# EAGLE design microverb (EAGLE 6.6.0)
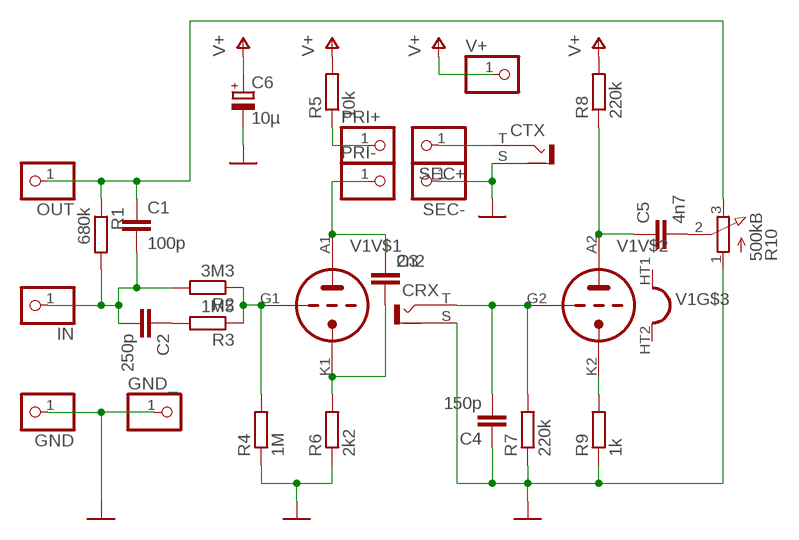
[diagram p0: schematic, sheet 1]

## Parts
C1  100p  C-EUC1206  [C1206]
C2  250p  C-EUC1206  [C1206]
C3  2n2  C-EUC1206  [C1206]
C4  150p  C-EUC1206  [C1206]
C5  4n7  C-EUC1206  [C1206]
C6  10µ  CPOL-EUE5-10.5  [E5-10,5]
CRX  BTOR1  [BTOR1]
CTX  BTOR1  [BTOR1]
GND  PINHD-1X1  [1X01]
GND_  PINHD-1X1  [1X01]
IN  PINHD-1X1  [1X01]
OUT  PINHD-1X1  [1X01]
PRI+  PINHD-1X1  [1X01]
PRI-  PINHD-1X1  [1X01]
R1  680k  R-EU_R1206  [R1206]
R2  3M3  R-EU_R1206  [R1206]
R3  1M5  R-EU_R1206  [R1206]
R4  1M  R-EU_R1206  [R1206]
R5  10k  R-EU_R2512  [R2512]
R6  2k2  R-EU_R1206  [R1206]
R7  220k  R-EU_R1206  [R1206]
R8  220k  R-EU_R1206  [R1206]
R9  1k  R-EU_R1206  [R1206]
R10  500kB  3RP/1610N  [3RP/1610N]
SEC+  PINHD-1X1  [1X01]
SEC-  PINHD-1X1  [1X01]
V1  6NXX-PIT  [6NXX-PIT]
V+  PINHD-1X1  [1X01]

## Nets
GND: C4.1 C6.- CRX.S CTX.S GND.1 GND_.1 R4.1 R6.1 R7.1 R9.1 R10.1(A) SEC-.1
N$1: C3.2 R6.2 V1.K1(V$1:TK)
N$2: R2.1 R3.1 R4.2 V1.G1(V$1:TG)
N$3: C4.2 CRX.T R7.2 V1.G2(V$2:TG)
N$4: R9.2 V1.K2(V$2:TK)
N$5: C2.1 R3.2
N$8: C5.1 R8.1 V1.A2(V$2:TA)
N$9: PRI+.1 R5.1
N$10: C3.1 PRI-.1 V1.A1(V$1:TA)
N$12: CTX.T SEC+.1
N$23: C1.2 C2.2 IN.1 R1.2 R2.2
N$24: C5.2 R10.2(S)
N$25: C1.1 OUT.1 R1.1 R10.3(E)
V+: C6.+ R5.2 R8.2 V+.1
Unconnected: CRX.S@1 CRX.S@2 CRX.S@3 CTX.S@1 CTX.S@2 CTX.S@3 V1.HT1(H1) V1.HT2(H2)

## Library data of the parts
C1-C5 = rcl:C-EU: CAPACITOR, European symbol
C6 = rcl:CPOL-EU: POLARIZED CAPACITOR, European symbol
CRX CTX = con-lumberg:BTOR1: RCA connectors according to JEITA RC-5231 Cinch RCA-Einbaukupplung nach JEITA RC-5231, stehende Ausführung Source: http://www.lumberg.de/Produkte/PDFs/BTOR1.pdf; MPN: BTOR 1; OC_FARNELL: 1217030; OC_NEWARK: 96K7172
GND GND_ IN OUT PRI+ PRI- SEC+ SEC- V+ = adafruit:PINHD-1X1: Pin header 1x1 for 0.1" spacing With round pins
R1-R9 = rcl:R-EU_: RESISTOR, European symbol
R10 = pot:3RP/1610N: 16mm Potentiometer one level Source: http://www.alphapotentiometers.net/html/16mm_pot_2.html
V1 = tubesC:6NXX-PIT

## Board
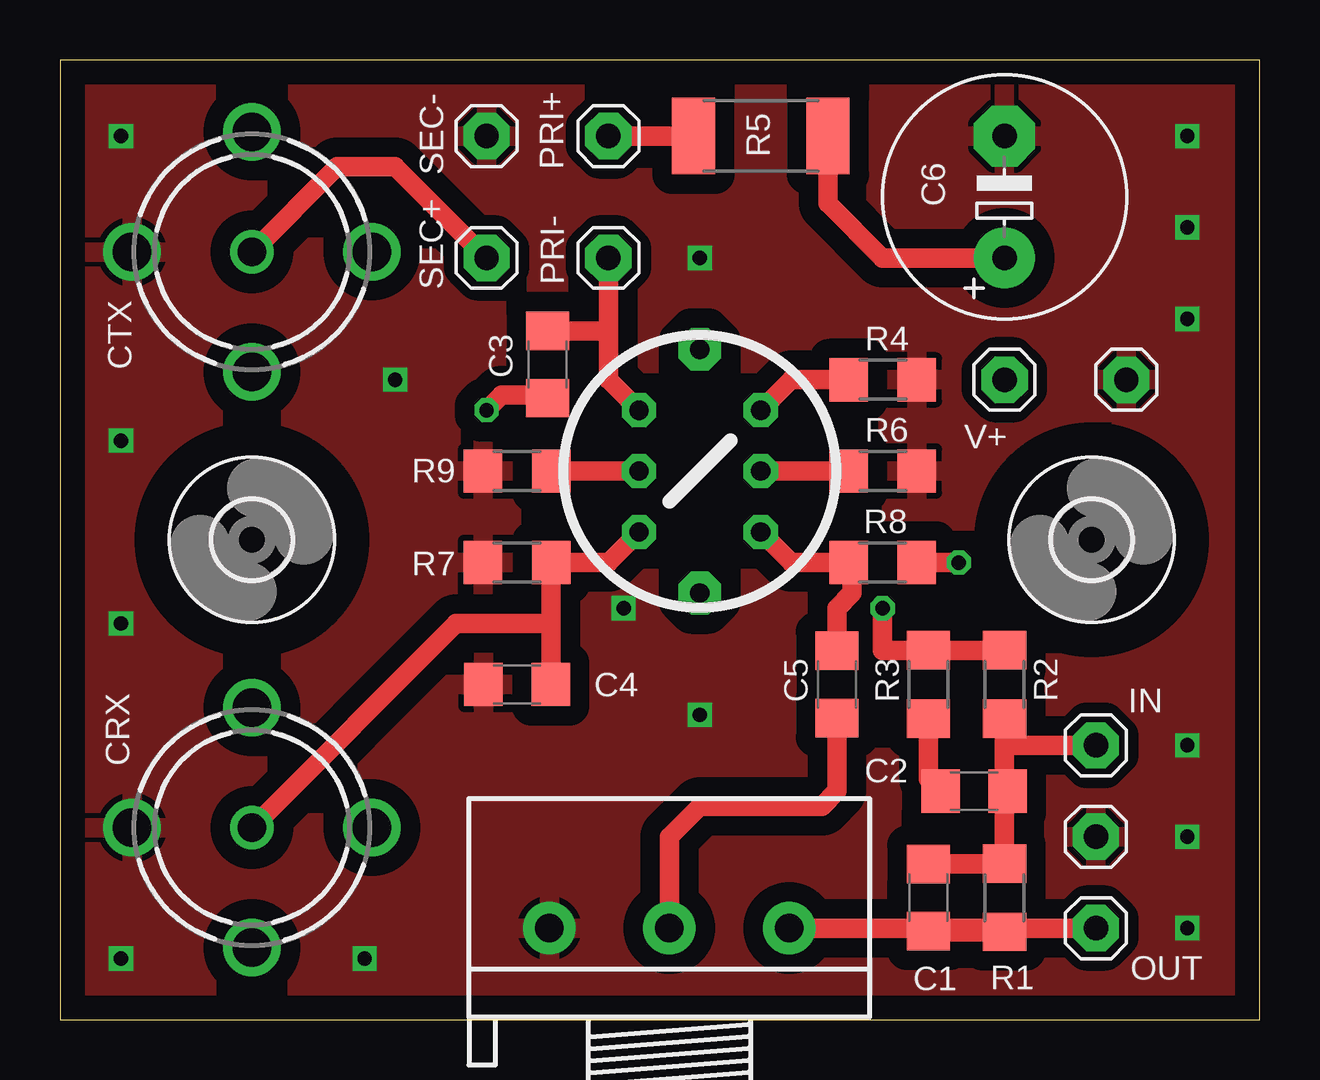
[diagram p1: board, top side]
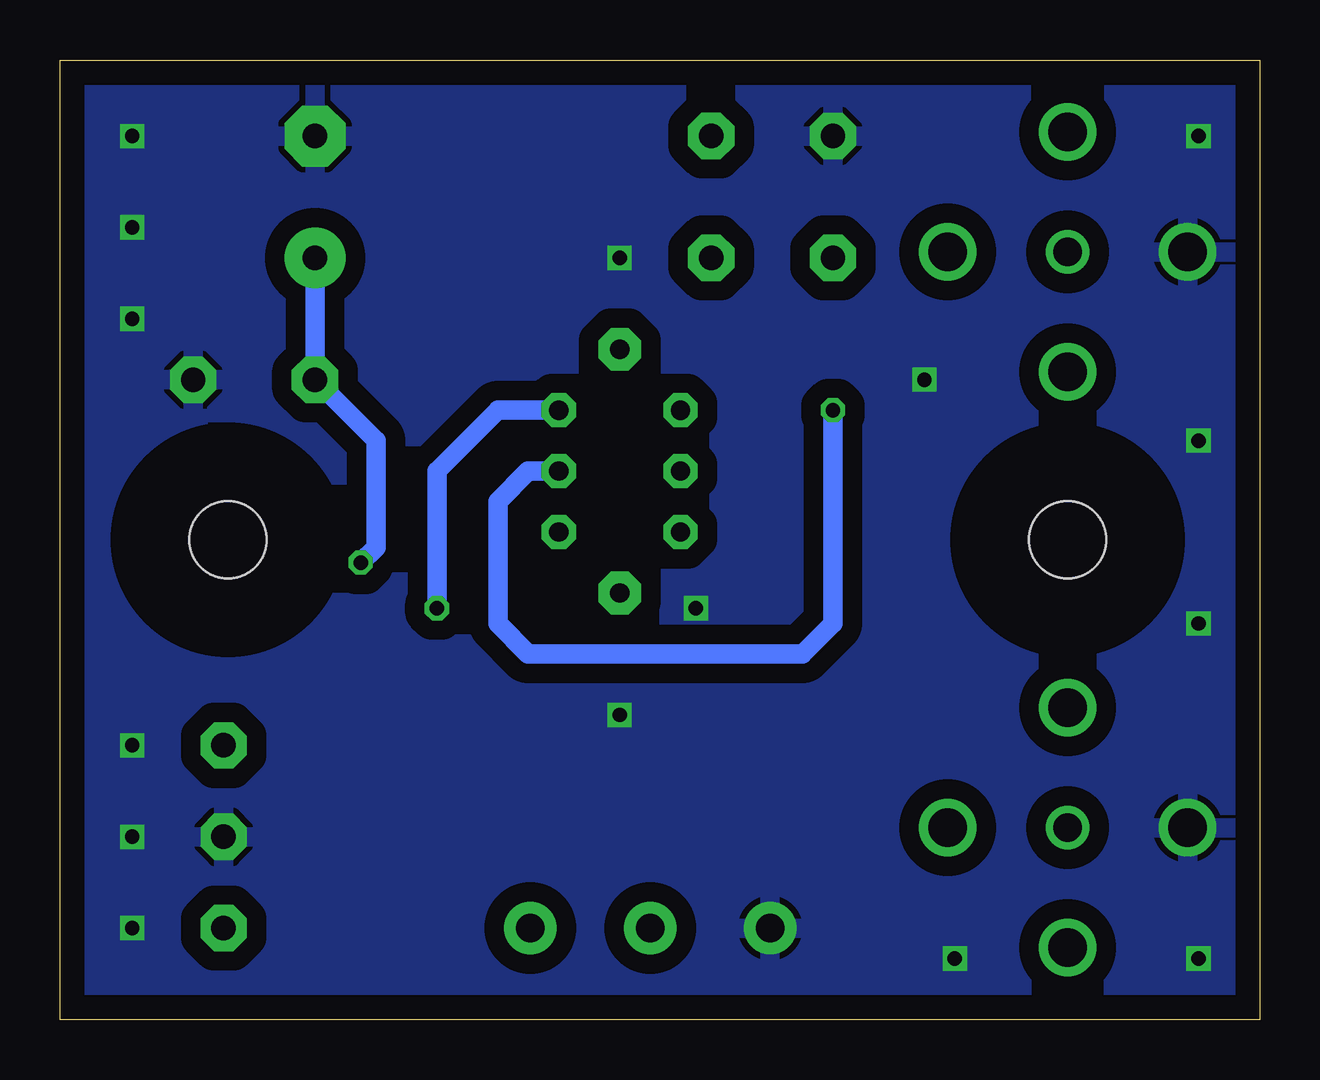
[diagram p2: board, bottom side, seen from below]

Size 50 x 40 mm. Coordinates in mm from the lower left corner, seen from the top.
Outline: 0,0 50,0 50,40 0,40 0,0
Copper layers (1*16): Top 0.035mm / dielectric 1.5mm / Bottom 0.035mm
Design rules "default": minimum track width 10mil, minimum drill 24mil, track to track 8mil, track to pad 8mil, pad to pad 8mil, via to via 8mil, smd to smd 8mil, copper to edge 40mil, drill to drill 8mil, minimum pad ring 10mil, minimum via ring 8mil, stop-mask expansion 4mil, vias tented up to drill 0mil, thermal gap 10mil

### Footprints (pad centres in the part's own frame; a part is rotated, then mirrored left to right if it is on the bottom)
C1206 = smd 1.6 x 1.8: 1 -1.4,0; 2 1.4,0
E5-10,5 = drill 1.016 pad 2.54: + -2.54,0 | drill 1.016 pad 2.54 octagon: - 2.54,0
BTOR1 = drill 1.6 pad 2.2: S -5,0; S@1 0,5; S@2 5,0; S@3 0,-5 | drill 1.2 pad 1.6: T 0,0
1X01 = drill 1.016 pad 1.93 octagon: 1 0,0
R1206 = smd 1.6 x 1.803: 1 -1.422,0; 2 1.422,0
R2512 = smd 1.8 x 3.2: 1 -2.8,0; 2 2.8,0
3RP/1610N = drill 1.2 pad 2.184: 1 -5,0; 2 0,0; 3 5,0
3,2 = hole 3.2: 0,0
6NXX-PIT = drill 0.8 pad 1.422 octagon: A1 2.54,-2.54; A2 -2.54,2.54; G1 -2.54,-2.54; G2 2.54,2.54; K1 -2.54,0; K2 2.54,0 | drill 0.8 pad 1.778 octagon: HT1 0,5.08; HT2 0,-5.08

### Placement (x,y rotation side)
C1  36.2,5.08 90 top
C2  38.1,9.53 0 top
C3  20.32,27.3 270 top
C4  19.05,13.97 0 top
C5  32.38,13.97 270 top
C6  39.37,34.29 90 top
CRX  8,8 0 top
CTX  8,32 0 top
GND  44.45,26.67 0 top
GND_  43.18,7.62 0 top
IN  43.18,11.43 0 top
OUT  43.18,3.81 0 top
PRI+  22.86,36.83 0 top
PRI-  22.86,31.75 0 top
R1  39.37,5.08 90 top
R2  39.37,13.97 270 top
R3  36.2,13.97 270 top
R4  34.29,26.67 180 top
R5  29.21,36.83 0 top
R6  34.29,22.86 180 top
R7  19.05,19.05 0 top
R8  34.29,19.05 0 top
R9  19.05,22.86 0 top
R10  25.4,3.81 0 top
SEC+  17.78,31.75 0 top
SEC-  17.78,36.83 0 top
U$2  [3,2]  8,20 0 top
U$3  [3,2]  43,20 0 top
V1  26.67,22.86 180 top
V+  39.37,26.67 0 top

### Tracks (layer width: path | path; a pad name or v marks a point on that pad's centre or on a via)
GND  (via drill 0.6)
  other vias: 2.54,36.83 2.54,24.13 2.54,16.51 2.54,2.54 12.7,2.54 46.99,3.81 46.99,7.62 46.99,11.43 46.99,29.21 46.99,33.02 46.99,36.83 26.67,12.7 23.5,17.14 26.67,31.75 13.97,26.67
  pour Top (isolate 0.813): 0,40.64 57.15,40.64 57.15,0 0,0
  pour Bottom (isolate 0.813): 0,40.64 0,0 57.15,0 57.15,40.64
N$1  (via drill 0.6)
  Top 0.813: V1.K1 R6.2 | v17.78,25.4 18.41,26.04 20.19,26.04 C3.2
  Bottom 0.813: V1.K1 30.48,22.86 31.75,21.59 31.75,16.51 30.48,15.24 19.05,15.24 17.78,16.51 v17.78,25.4
N$2  (via drill 0.6)
  Top 0.813: v34.29,17.14 34.29,15.39 R3.1 R2.1 | R4.2 30.48,26.67 V1.G1
  Bottom 0.813: v34.29,17.14 34.29,22.86 31.75,25.4 V1.G1
N$3
  Top 0.813: V1.G2 22.86,19.05 R7.2 | R7.2 20.47,16.66 20.32,16.51 16.51,16.51 CRX.T | C4.2 20.47,13.99 R7.2
N$4
  Top 0.813: V1.K2 R9.2
N$5
  Top 0.813: R3.2 36.2,10.03 C2.1
N$8
  Top 0.813: V1.A2 30.48,19.05 R8.1 33.02,18.9 33.02,17.78 32.38,17.14 C5.1
N$9
  Top 0.813: R5.1 PRI+.1
N$10
  Top 0.813: V1.A1 22.86,26.67 22.86,28.7 | C3.1 22.86,28.7 | 22.86,28.7 PRI-.1
N$12
  Top 0.813: SEC+.1 13.97,35.56 11.56,35.56 CTX.T
N$23
  Top 0.813: C1.2 39.37,6.48 R1.2 39.37,9.53 | C2.2 39.37,9.53 | 39.37,9.53 39.37,11.43 | 39.37,11.43 R2.2 | IN.1 39.37,11.43
N$24
  Top 0.813: R10.2 25.4,7.62 26.67,8.89 31.75,8.89 32.38,9.53 C5.2
N$25
  Top 0.813: R10.3 OUT.1 39.37,3.81 R1.1 36.2,3.66 C1.1
V+  (via drill 0.6)
  Top 0.813: R8.2 v37.47,19.05 | R5.2 32.01,34.03 34.29,31.75 C6.+
  Bottom 0.813: v37.47,19.05 36.83,19.68 36.83,24.13 V+.1 C6.+